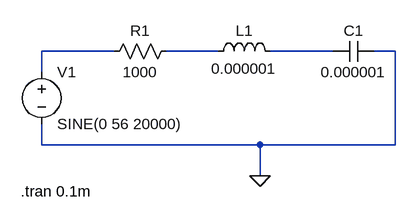
[diagram p0: schematic RLC CKT.asc]
RLC CKT.asc, the LTspice schematic file:
Version 4.1
SHEET 1 880 680
WIRE 80 112 -32 112
WIRE 240 112 160 112
WIRE 416 112 320 112
WIRE 512 112 480 112
WIRE -32 144 -32 112
WIRE -32 256 -32 224
WIRE 304 256 -32 256
WIRE 512 256 512 112
WIRE 512 256 304 256
WIRE 304 304 304 256
FLAG 304 304 0
SYMBOL res 176 96 R90
WINDOW 0 0 56 VBottom 2
WINDOW 3 32 56 VTop 2
SYMATTR InstName R1
SYMATTR Value 1000
SYMBOL ind 224 128 R270
WINDOW 0 32 56 VTop 2
WINDOW 3 5 56 VBottom 2
SYMATTR InstName L1
SYMATTR Value 0.000001
SYMBOL cap 480 96 R90
WINDOW 0 0 32 VBottom 2
WINDOW 3 32 32 VTop 2
SYMATTR InstName C1
SYMATTR Value 0.000001
SYMBOL voltage -32 128 R0
WINDOW 123 0 0 Left 0
WINDOW 39 0 0 Left 0
SYMATTR InstName V1
SYMATTR Value SINE(0 56 20000)
TEXT -64 328 Left 2 !.tran 0.1m

The netlist it stands for:
* RLC CKT.asc
R1 N002 N001 1000
L1 N002 N003 0.000001
C1 0 N003 0.000001
V1 N001 0 SINE(0 56 20000)
.tran 0.1m
.backanno
.end